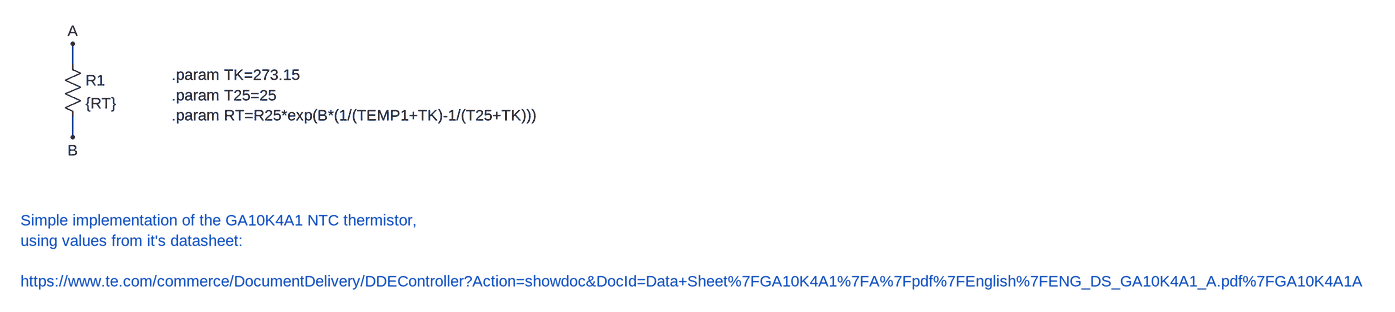
[diagram p0: schematic GA10K4A1A_NTC.asc]
GA10K4A1A_NTC.asc, the LTspice schematic file:
Version 4
SHEET 1 2384 680
WIRE 192 112 192 80
WIRE 192 224 192 192
FLAG 192 80 A
FLAG 192 224 B
SYMBOL res 176 96 R0
SYMATTR InstName R1
SYMATTR Value {RT}
TEXT 344 128 Left 2 !.param TK=273.15\n.param T25=25\n.param RT=R25*exp(B*(1/(TEMP1+TK)-1/(T25+TK)))
TEXT 112 352 Left 2 ;Simple implementation of the GA10K4A1 NTC thermistor, \nusing values from it's datasheet:\n \nhttps://www.te.com/commerce/DocumentDelivery/DDEController?Action=showdoc&DocId=Data+Sheet%7FGA10K4A1%7FA%7Fpdf%7FEnglish%7FENG_DS_GA10K4A1_A.pdf%7FGA10K4A1A

The netlist it stands for:
* GA10K4A1A_NTC.asc
R1 A B {RT}
.param TK=273.15
.param T25=25
.param RT=R25*exp(B*(1/(TEMP1+TK)-1/(T25+TK)))
* Simple implementation of the GA10K4A1 NTC thermistor,
* using values from it's datasheet:
* https://www.te.com/commerce/DocumentDelivery/DDEController?Action=showdoc&DocId=Data+Sheet%7FGA10K4A1%7FA%7Fpdf%7FEnglish%7FENG_DS_GA10K4A1_A.pdf%7FGA10K4A1A
.backanno
.end